# Altium project AUV maincontrol V2.0.PrjPcb
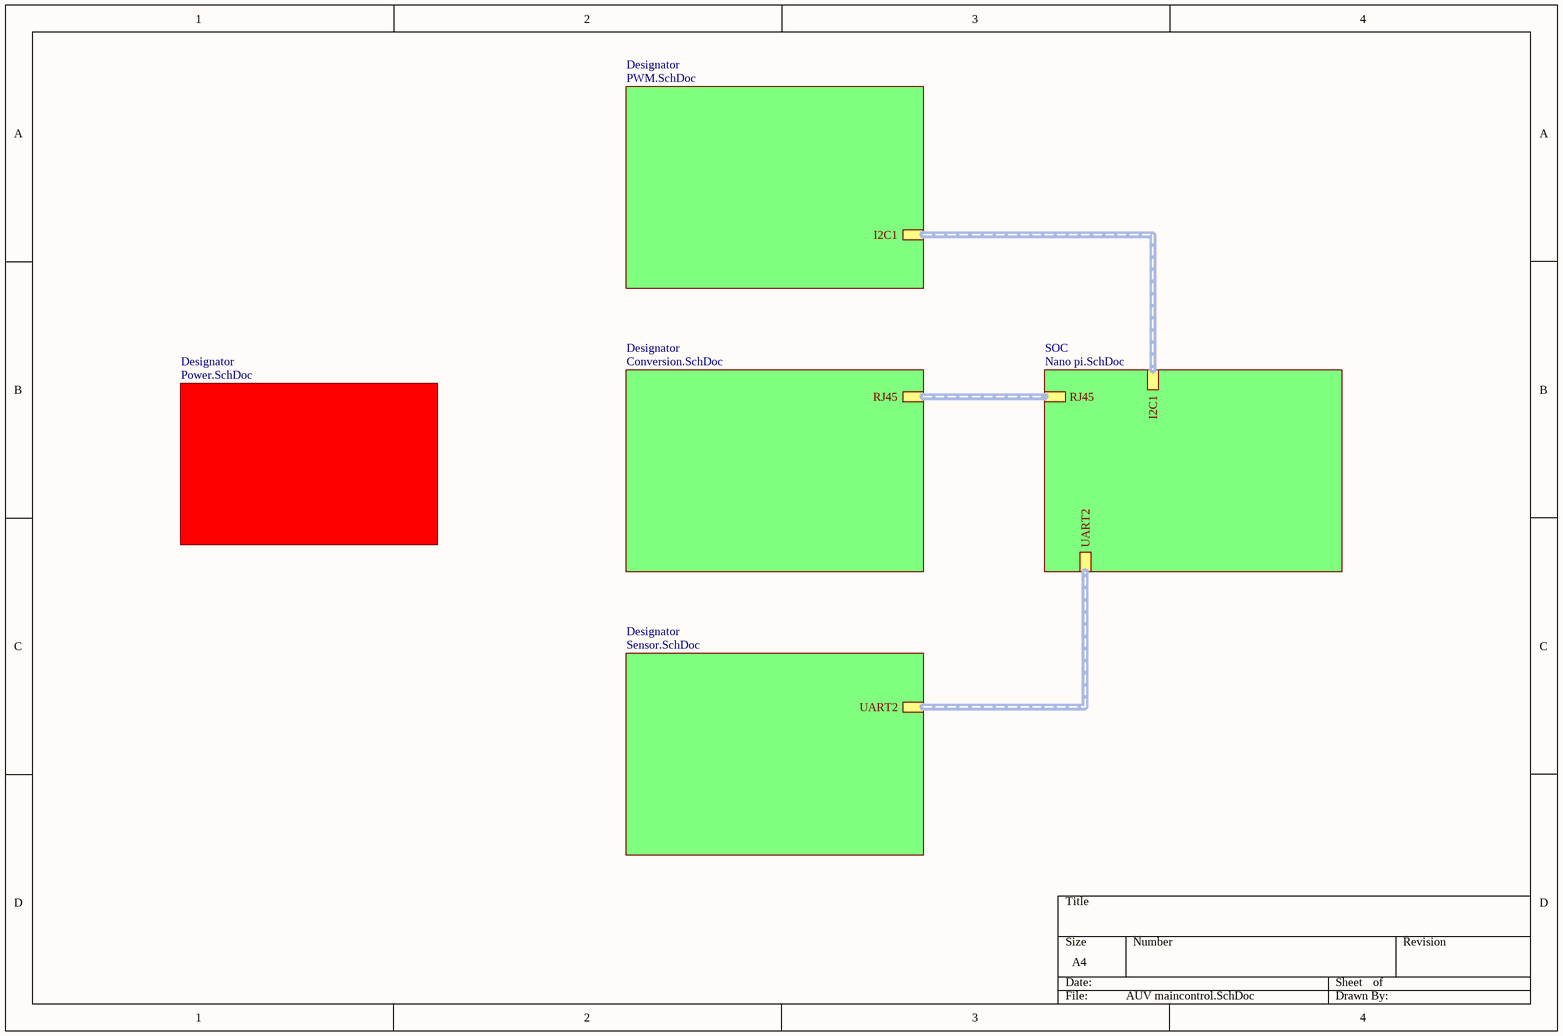
[diagram p0: AUV maincontrol.SchDoc]
6 sheets, 195 parts. Net scope: hierarchical (ports join the sheet entries above them; power ports are global).
Board file: AUV maincontrol.PcbDoc
Sheets:
  AUV maincontrol.SchDoc
    SOC = Nano pi.SchDoc
    Designator = Power.SchDoc
    Designator = Conversion.SchDoc
    Designator = PWM.SchDoc
    Designator = Sensor.SchDoc

## Sheet AUV maincontrol.SchDoc
size A4; SheetNumber: 1; SheetTotal: 6

### Sub-sheets
Designator = Power.SchDoc: no entries
Designator = Conversion.SchDoc: RJ45
Designator = PWM.SchDoc: I2C1
Designator = Sensor.SchDoc: UART2
SOC = Nano pi.SchDoc: RJ45, UART2, I2C1

### Buses and harness runs
harness sheet Designator/I2C1 = sheet SOC/I2C1
harness sheet Designator/RJ45 = sheet SOC/RJ45
harness sheet Designator/UART2 = sheet SOC/UART2

## Sheet Nano pi.SchDoc
size A3; SheetNumber: 3; SheetTotal: 6
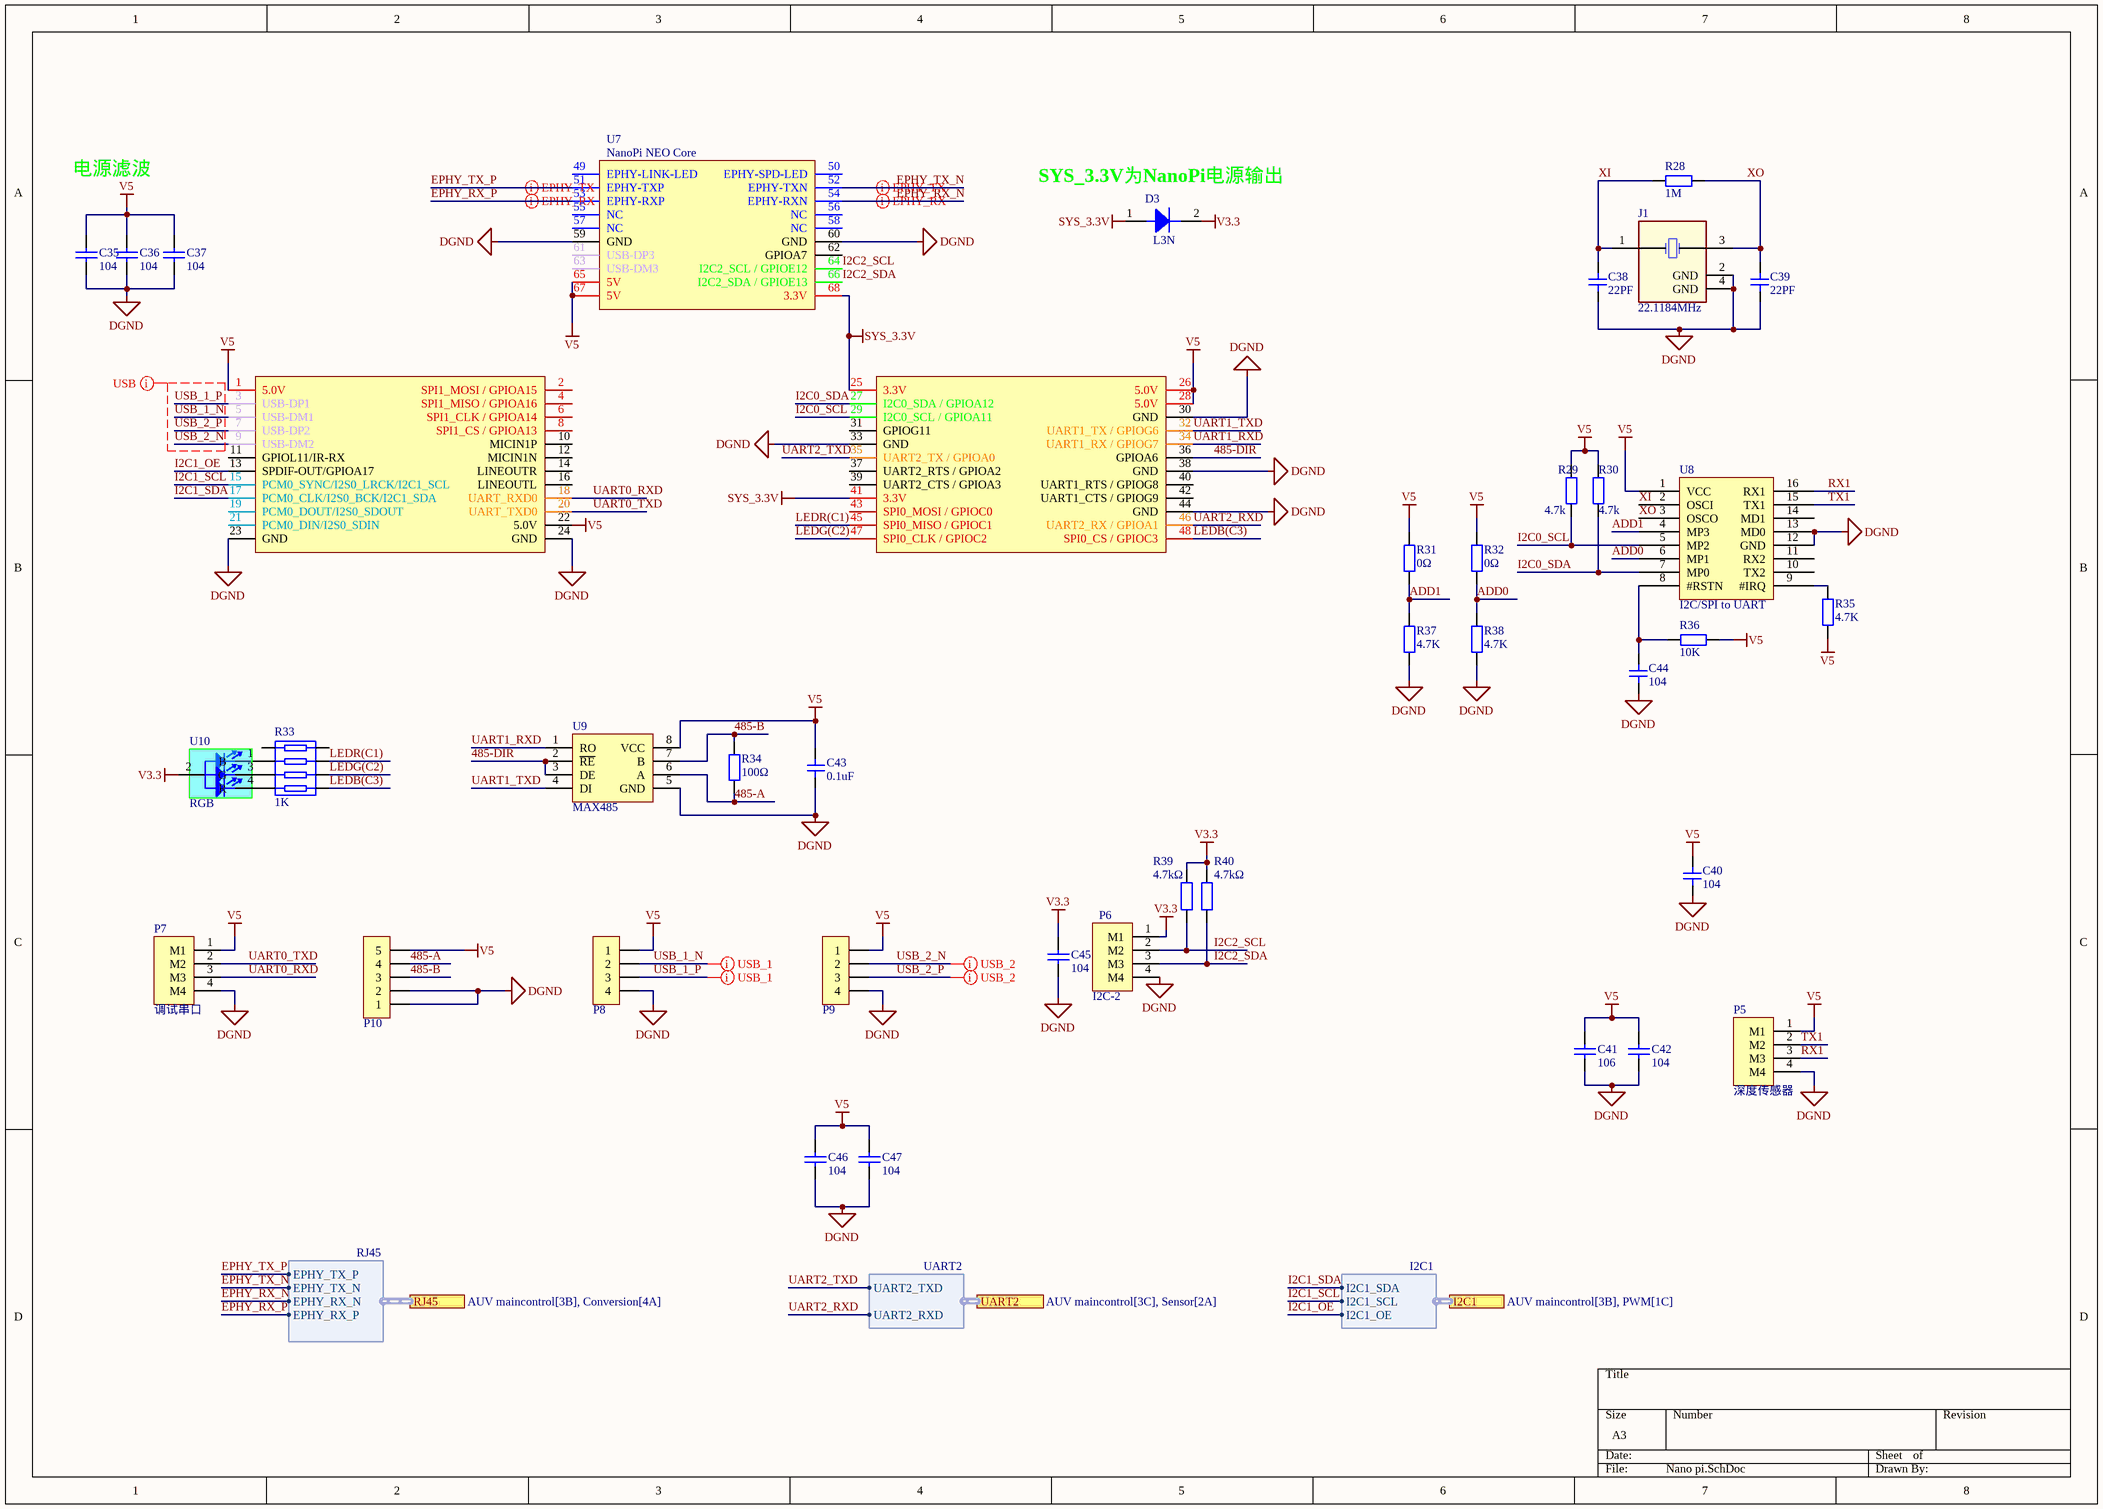
[diagram p1: Nano pi.SchDoc]

### Parts
C35  104  [0603_C]
C36  104  [0603_C]
C37  104  [0603_C]
C38  22PF  [0603_C]
C39  22PF  [0603_C]
C40  104  [0603_C]
C41  106  [0603_C]
C42  104  [0603_C]
C43  0.1uF  [0603_C]
C44  104  [0603_C]
C45  104  [0603_C]
C46  104  [0603_C]
C47  104  [0603_C]
D3  L3N  [SOD-123]
J1  22.1184MHz  [SMD-3225_4P]
P5  深度传感器  [MX1.25S-4P]
P6  I2C-2  [MX1.25S-4P]
P7  调试串口  [MX1.25S-4P]
P8  HDR-1X4  [PH2.0-LS-4P]  (value not drawn)
P9  HDR-1X4  [PH2.0-LS-4P]  (value not drawn)
P10  HDR-1X5  [PH2.0-LS-5P]  (value not drawn)
R28  1M  [0603R]
R29  4.7k  [0603R]
R30  4.7k  [0603R]
R31  0Ω  [0603R]
R32  0Ω  [0603R]
R33  1K  [res-4]
R34  100Ω  [0603R]
R35  4.7K  [0603R]
R36  10K  [0603R]
R37  4.7K  [0603R]
R38  4.7K  [0603R]
R39  4.7kΩ  [0603_R]
R40  4.7kΩ  [0603_R]
U7  NanoPi NEO Core  [NanoPi NEO Core(无引脚名)]
U8  I2C/SPI to UART  [SOP65P780X195-16N]
U9  MAX485  [SOP-8]
U10  RGB  [RGB-3528]

### Ports
I2C1 (harness I2C1, see AUV maincontrol[3B], PWM[1C]), RJ45 (harness RJ45, see AUV maincontrol[3B], Conversion[4A]), UART2 (harness UART2, see AUV maincontrol[3C], Sensor[2A])

### Harnesses
RJ45: EPHY_TX_P, EPHY_TX_N, EPHY_RX_N, EPHY_RX_P
UART2: UART2_TXD, UART2_RXD
I2C1: I2C1_SDA, I2C1_SCL, I2C1_OE

### Nets
DGND: C35.1 C36.1 C37.1 C38.2 C39.2 C40.2 C41.1 C42.1 C43.1 C44.2 C45.1 C46.1 C47.1 J1.2(GND) J1.4(GND) P5.4(M4) P6.4(M4) P7.4(M4) P8.4 P9.4 P10.1 P10.2 R37.1 R38.1 U7.23(GND) U7.24(GND) U7.30(GND) U7.33(GND) U7.38(GND) U7.44(GND) U7.59(GND) U7.60(GND) U8.12(GND) U8.13(MD0) U9.5(GND)
SYS_3.3V: D3.1 U7.25(3.3V) U7.41(3.3V) U7.68(3.3V)
V3.3: C45.2 D3.2 P6.1(M1) R39.2 R40.2 U10.2
V5: C35.2 C36.2 C37.2 C40.1 C41.2 C42.2 C43.2 C46.2 C47.2 P5.1(M1) P7.1(M1) P8.1 P9.1 P10.5 R29.2 R30.2 R31.2 R32.2 R35.1 R36.2 U7.1(5.0V) U7.22(5.0V) U7.26(5.0V) U7.28(5.0V) U7.65(5V) U7.67(5V) U8.1(VCC) U9.8(VCC)
485-A: P10.4 R34.1 U9.6(A)
485-B: P10.3 R34.2 U9.7(B)
485-DIR: U7.36(GPIOA6) U9.2(~{RE}) U9.3(DE)
ADD0: R32.1 R38.2 U8.6(MP1)
ADD1: R31.1 R37.2 U8.4(MP3)
EPHY_RX_N: U7.54(EPHY-RXN) ; port RJ45.EPHY_RX_N
EPHY_RX_P: U7.53(EPHY-RXP) ; port RJ45.EPHY_RX_P
EPHY_TX_N: U7.52(EPHY-TXN) ; port RJ45.EPHY_TX_N
EPHY_TX_P: U7.51(EPHY-TXP) ; port RJ45.EPHY_TX_P
I2C0_SCL: R29.1 U7.29(I2C0_SCL_/_GPIOA11) U8.5(MP2)
I2C0_SDA: R30.1 U7.27(I2C0_SDA_/_GPIOA12) U8.7(MP0)
I2C1_OE: U7.13(SPDIF-OUT/GPIOA17) ; port I2C1.I2C1_OE
I2C1_SCL: U7.15(PCM0_SYNC/I2S0_LRCK/I2C1_SCL) ; port I2C1.I2C1_SCL
I2C1_SDA: U7.17(PCM0_CLK/I2S0_BCK/I2C1_SDA) ; port I2C1.I2C1_SDA
I2C2_SCL: P6.2(M2) R39.1 U7.64(I2C2_SCL_/_GPIOE12)
I2C2_SDA: P6.3(M3) R40.1 U7.66(I2C2_SDA_/_GPIOE13)
LEDB(C3): R33.5 U7.48(SPI0_CS_/_GPIOC3)
LEDG(C2): R33.6 U7.47(SPI0_CLK_/_GPIOC2)
LEDR(C1): R33.7 U7.45(SPI0_MISO_/_GPIOC1)
RX1: P5.3(M3) U8.16(RX1)
TX1: P5.2(M2) U8.15(TX1)
UART0_RXD: P7.3(M3) U7.18(UART_RXD0)
UART0_TXD: P7.2(M2) U7.20(UART_TXD0)
UART1_RXD: U7.34(UART1_RX_/_GPIOG7) U9.1(RO)
UART1_TXD: U7.32(UART1_TX_/_GPIOG6) U9.4(DI)
UART2_RXD: U7.46(UART2_RX_/_GPIOA1) ; port UART2.UART2_RXD
UART2_TXD: U7.35(UART2_TX_/_GPIOA0) ; port UART2.UART2_TXD
USB_1_N: P8.2 U7.5(USB-DM1)
USB_1_P: P8.3 U7.3(USB-DP1)
USB_2_N: P9.2 U7.9(USB-DM2)
USB_2_P: P9.3 U7.7(USB-DP2)
XI: C38.1 J1.1(OSC1) R28.2 U8.2(OSCI)
XO: C39.1 J1.3(OSC2) R28.1 U8.3(OSCO)
NetC44_1: C44.1 R36.1 U8.8(#RSTN)
NetR33_2: R33.2 U10.1(B)
NetR33_3: R33.3 U10.3(G)
NetR33_4: R33.4 U10.4(R)
NetR35_2: R35.2 U8.9(#IRQ)

Not connected (* = marked no-connect by the designer): R33 1 8; U7 2(SPI1_MOSI_/_GPIOA15) 4(SPI1_MISO_/_GPIOA16) 6(SPI1_CLK_/_GPIOA14) 8(SPI1_CS_/_GPIOA13) 10(MICIN1P) 11(GPIOL11/IR-RX) 12(MICIN1N) 14(LINEOUTR) 16(LINEOUTL) 19(PCM0_DOUT/I2S0_SDOUT) 21(PCM0_DIN/I2S0_SDIN) 31(GPIOG11) 37(UART2_RTS_/_GPIOA2) 39(UART2_CTS_/_GPIOA3) 40(UART1_RTS_/_GPIOG8) 42(UART1_CTS_/_GPIOG9) 43(SPI0_MOSI_/_GPIOC0) 49(EPHY-LINK-LED) 50(EPHY-SPD-LED) 55(NC) 56(NC) 57(NC) 58(NC) 61(USB-DP3) 62(GPIOA7) 63(USB-DM3); U8 10(TX2) 11(RX2) 14(MD1)

### Layout directives
differential pair: EPHY_RX_N, EPHY_RX_P, EPHY_TX_N, EPHY_TX_P, USB_1_N, USB_1_P, USB_2_N, USB_2_P
net class USB: USB_1_N, USB_1_P, USB_2_N, USB_2_P

### Notes on the sheet
- 电源滤波
- (near U7) SYS_3.3V为NanoPi电源输出

### Library data of the parts
C35-C37 C41 C42 C45-C47 = SMT_Cap: 贴片电容; ComponentLink1Description: 供应商链接; ComponentLink1URL: http://www.szlcsc.com/product/details_29010.html; Package: 0805; Supplier: LC; SuppliersPartNumber: C28260
C38-C40 C43 C44 = Cap1: 无极贴片电容
D3 = Diode: 二极管30V/2A
J1 = Oscillator_SMT_4P
P5-P7 = 接线端子-4PIN: 4PIN
P8 P9 = Header 4: 4P接插件; 封装库来自淘宝卖家  ID：黄晶宝石: 其他店铺购入均为盗版假冒封装库，请立即申请退款; 技术支持，联系售后: 唯一出售店铺网址https://shop463601444.taobao.com
P10 = Header 5: 5P接插件; 封装库来自淘宝卖家  ID：黄晶宝石: 其他店铺购入均为盗版假冒封装库，请立即申请退款; 技术支持，联系售后: 唯一出售店铺网址https://shop463601444.taobao.com
R28-R32 R34-R38 = Res: 电阻
R33 = Res-4: 排阻
R39 R40 = SMT_Res: 贴片电阻; ComponentLink1Description: 供应商链接; ComponentLink1URL: http://www.szlcsc.com/product/details_23980.html; Package: 0603; Supplier: LC; SuppliersPartNumber: C23253
U8 = WK2132-ISSG

## Sheet Power.SchDoc
size A3; SheetNumber: 2; SheetTotal: 6
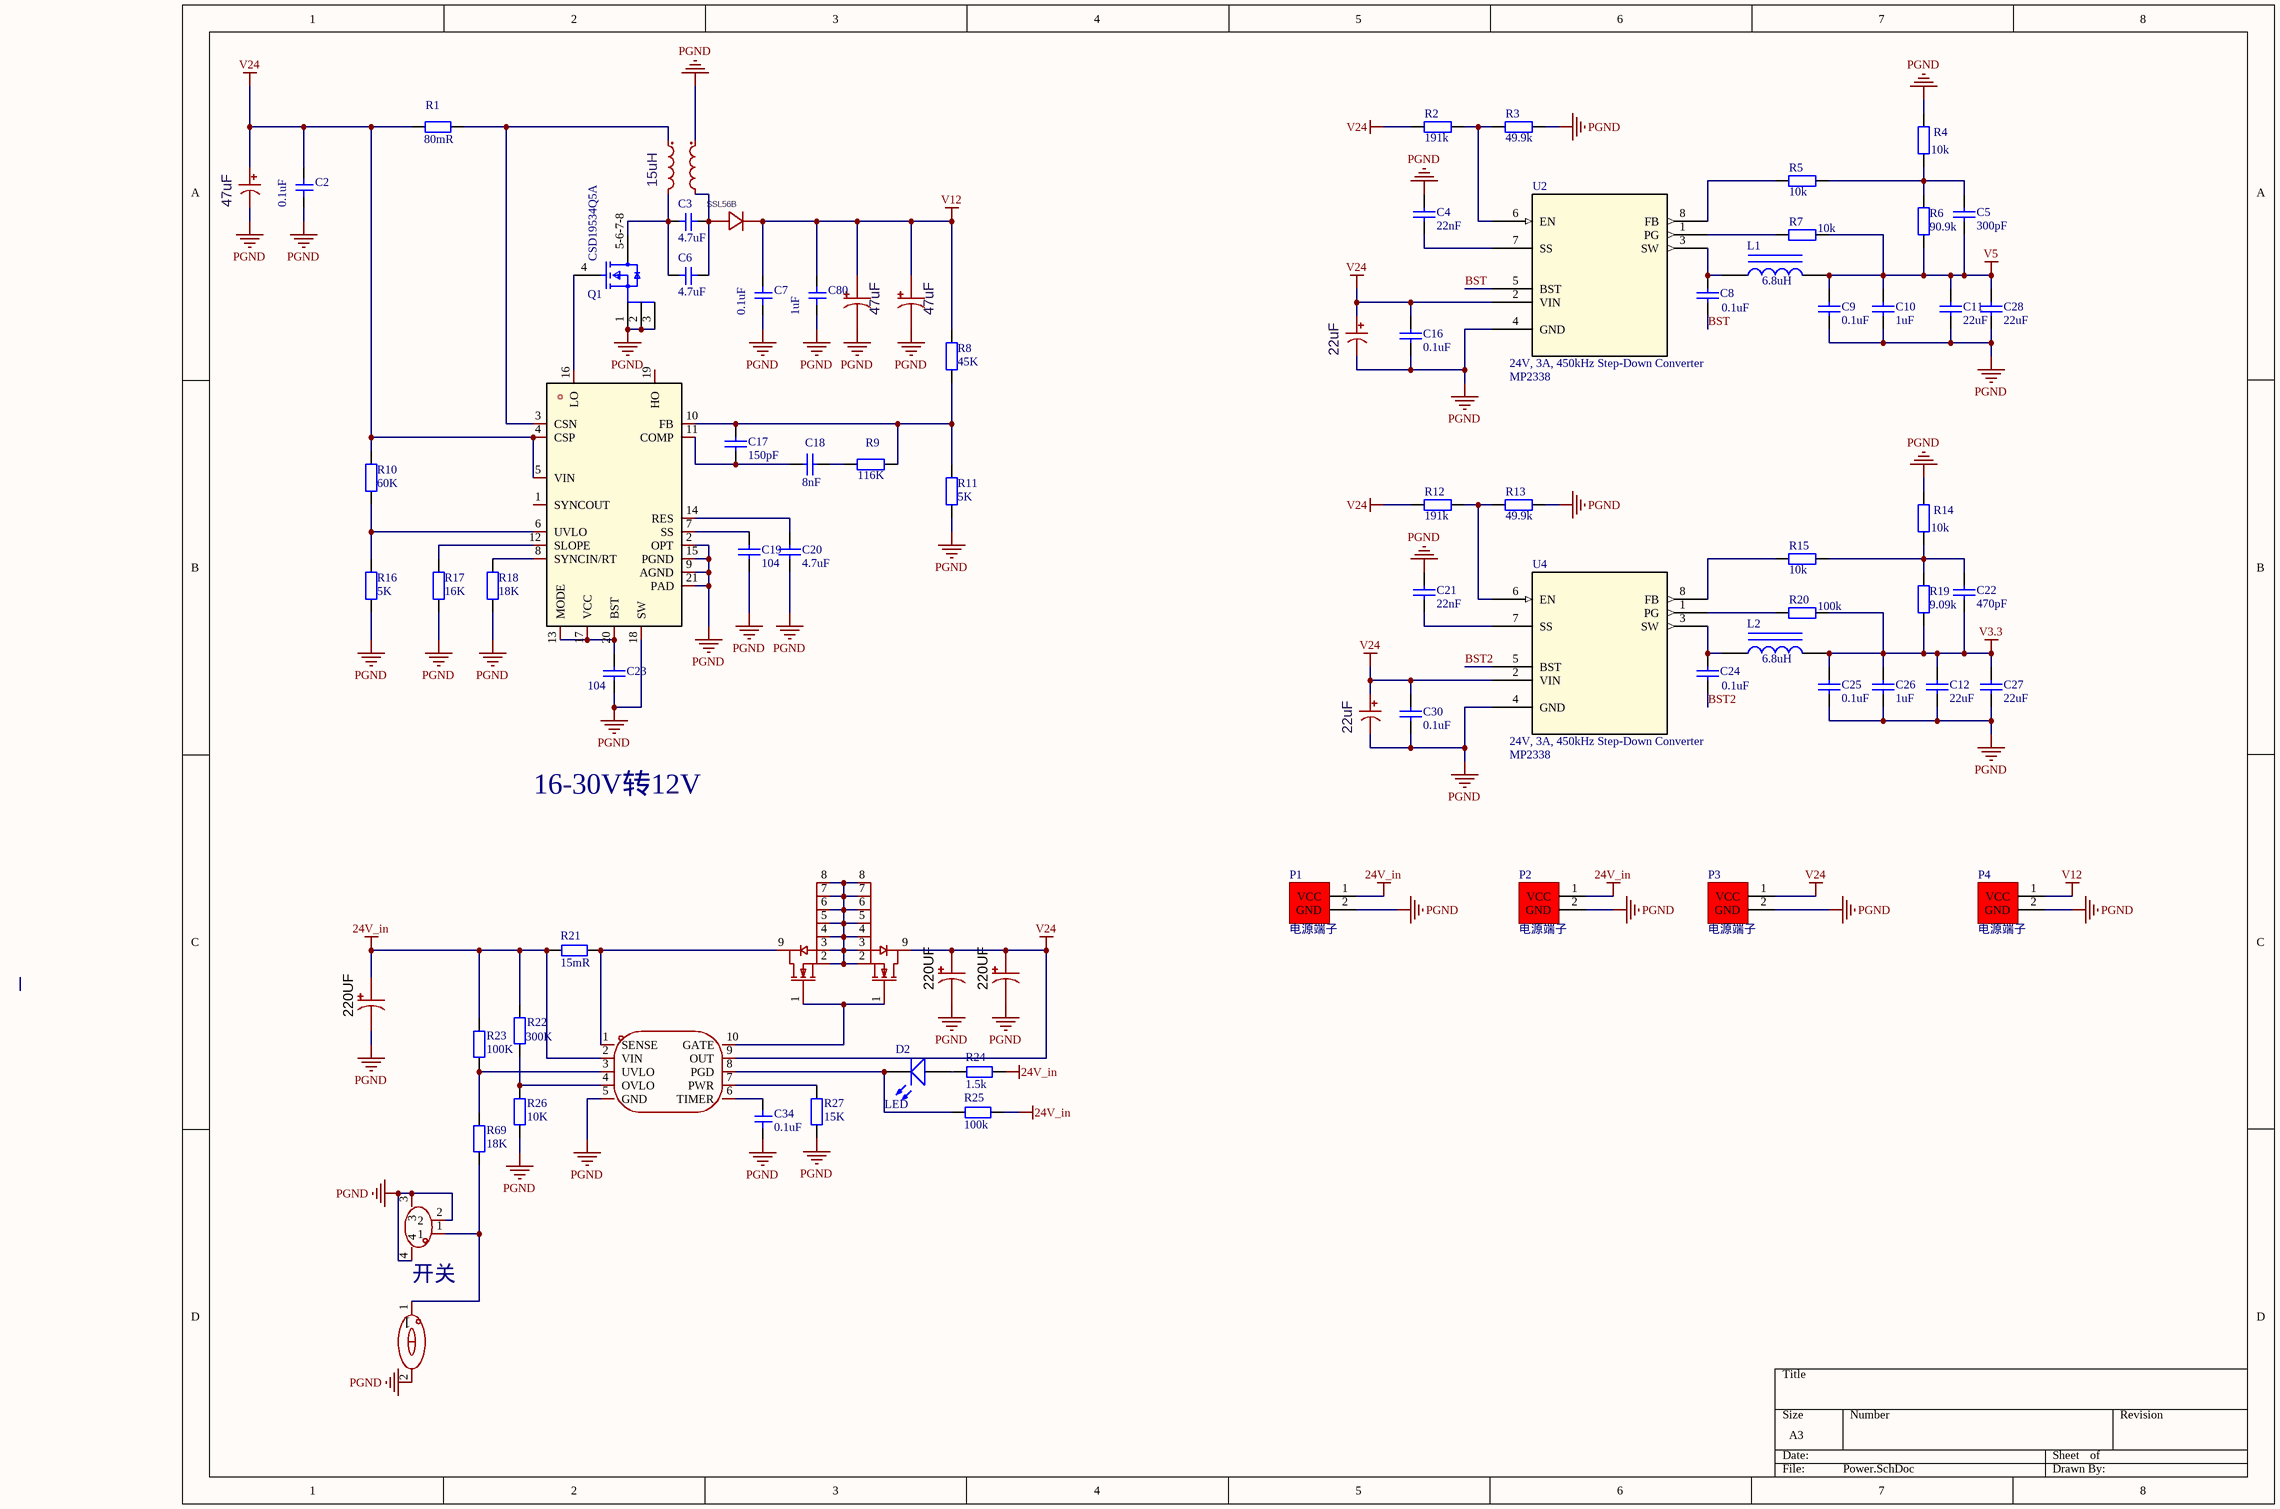
[diagram p2: Power.SchDoc]

### Parts
C1  47uF  [CAP-SMD_BD6.3-L6.6-W6.6-LS7.6-FD]
C2  0.1uF  [0603C]
C3  4.7uF  [1206_C]
C4  22nF  [0402_C]
C5  300pF  [0402_C]
C6  4.7uF  [1206_C]
C7  0.1uF  [0603C]
C8  0.1uF  [0603_C]
C9  0.1uF  [0603_C]
C10  1uF  [0603_C]
C11  22uF  [1210_C]
C12  22uF  [1210_C]
C13  47uF  [CAP-SMD_BD6.3-L6.6-W6.6-LS7.6-FD]
C14  47uF  [CAP-SMD_BD6.3-L6.6-W6.6-LS7.6-FD]
C15  22uF  [CAP-SMD_BD6.3-L6.6-W6.6-LS7.6-FD]
C16  0.1uF  [0603_C]
C17  150pF  [0402_C]
C18  8nF  [0402_C]
C19  104  [0402_C]
C20  4.7uF  [0603_C]
C21  22nF  [0402_C]
C22  470pF  [0402_C]
C23  104  [0402_C]
C24  0.1uF  [0603_C]
C25  0.1uF  [0603_C]
C26  1uF  [0603_C]
C27  22uF  [1210_C]
C28  22uF  [1210_C]
C29  22uF  [CAP-SMD_BD6.3-L6.6-W6.6-LS7.6-FD]
C30  0.1uF  [0603_C]
C31  220UF  [CAP-SMD_BD10.0-L10.3-W10.3-LS11.3-FD]
C32  220UF  [CAP-SMD_BD10.0-L10.3-W10.3-LS11.3-FD]
C33  220UF  [CAP-SMD_BD10.0-L10.3-W10.3-LS11.3-FD]
C34  0.1uF  [0402_C]
C80  1uF  [0603C]
D1  SSL56B  [SMBF_L4.3-W3.6-LS5.3-RD]
D2  LED  [0805_LED]
L1  6.8uH  [IND-SMD_L7.0-W6.6]
L2  6.8uH  [IND-SMD_L7.0-W6.6]
P1  电源端子  [XT60PB-F]
P2  电源端子  [XT60PB-F]
P3  电源端子  [XT60PB-F]
P4  电源端子  [XT30-F]
Q1  CSD19534Q5A  [FP-DQJ0008A-MFG]
Q2  HYG006N04LS1TA  [TOLL-8_L10.4-W9.9-P1.20-LS11.7-BL]  (value not drawn)
Q3  HYG006N04LS1TA  [TOLL-8_L10.4-W9.9-P1.20-LS11.7-BL]  (value not drawn)
R1  80mR  [2512]
R2  191k  [0402_R]
R3  49.9k  [0402_R]
R4  10k  [0402_R]
R5  10k  [0402_R]
R6  90.9k  [0402_R]
R7  10k  [0402_R]
R8  45K  [0402_R]
R9  116K  [0402_R]
R10  60K  [0402_R]
R11  5K  [0402_R]
R12  191k  [0402_R]
R13  49.9k  [0402_R]
R14  10k  [0402_R]
R15  10k  [0402_R]
R16  5K  [0402_R]
R17  16K  [0402_R]
R18  18K  [0402_R]
R19  9.09k  [0402_R]
R20  100k  [0402_R]
R21  15mR  [2512]
R22  300K  [0402_R]
R23  100K  [0402_R]
R24  1.5k  [0402_R]
R25  100k  [0402_R]
R26  10K  [0402_R]
R27  15K  [0402_R]
R69  18K  [0402_R]
SW1  DSIC01LS-P  [SW-SMD_2P-L3.5-W6.2-P2.54-LS9.8]  (value not drawn)
U1  15uH  [IND-SMD_4P-L12.0-W12.0_496R8C]
U2  24V, 3A, 450kHz Step-Down Converter  [SOT583_MP2338_MNP]
U3  LM5122MHX/NOPB  [HTSSOP-20_L6.5-W4.4-P0.65-LS6.4-BL-EP]  (value not drawn)
U4  24V, 3A, 450kHz Step-Down Converter  [SOT583_MP2338_MNP]
U5  LM5069MMX-2/NOPB  [VSSOP-10_L3.0-W3.0-P0.50-LS4.9-BL]  (value not drawn)
U6  ZX-XH2.54-2PLT  [HC-1.25-2]  (value not drawn)

### Nets
24V_in: C33.1 P1.1(VCC) P2.1(VCC) R21.2 R22.2 R23.2 R24.1 R25.1 U5.2(VIN)
PGND: C1.2 C2.1 C4.2 C7.1 C9.1 C10.1 C11.1 C12.1 C13.2 C14.2 C15.2 C16.1 C19.1 C20.1 C21.2 C23.1 C25.1 C26.1 C27.1 C28.1 C29.2 C30.1 C31.2 C32.2 C33.2 C34.1 C80.1 P1.2(GND) P2.2(GND) P3.2(GND) P4.2(GND) Q1.1(S) Q1.2(S) Q1.3(S) R3.1 R4.2 R11.1 R13.1 R14.2 R16.1 R17.1 R18.1 R26.1 R27.2 SW1.2(PIN2) U1.2 U2.4(GND) U3.2(OPT) U3.9(AGND) U3.15(PGND) U3.18(SW) U3.21(PAD) U4.4(GND) U5.5(GND) U6.2 U6.3 U6.4
V3.3: C12.2 C22.1 C25.2 C26.2 C27.2 L2.2 R19.1 R20.2
V5: C5.1 C9.2 C10.2 C11.2 C28.2 L1.2 R6.1 R7.2
V12: C7.2 C13.1 C14.1 C80.2 D1.1 P4.1(VCC) R8.2
V24: C1.1 C2.2 C15.1 C16.2 C29.1 C30.2 C31.1 C32.1 P3.1(VCC) Q3.9(D) R1.1 R2.2 R10.2 R12.2 U2.2(VIN) U3.4(CSP) U3.5(VIN) U4.2(VIN) U5.9(OUT)
BST: C8.1 U2.5(BST)
BST2: C24.1 U4.5(BST)
NetC3_1: C3.1 C6.1 Q1.5-6-7-8(D) U1.3
NetC3_2: C3.2 C6.2 D1.2 U1.4
NetC4_1: C4.1 U2.7(SS)
NetC5_2: C5.2 R4.1 R5.1 R6.2
NetC8_2: C8.2 L1.1 U2.3(SW)
NetC17_1: C17.1 C18.1 U3.11(COMP)
NetC17_2: C17.2 R8.1 R9.2 R11.2 U3.10(FB)
NetC18_2: C18.2 R9.1
NetC19_2: C19.2 U3.7(SS)
NetC20_2: C20.2 U3.14(RES)
NetC21_1: C21.1 U4.7(SS)
NetC22_2: C22.2 R14.1 R15.1 R19.2
NetC23_2: C23.2 U3.13(MODE) U3.17(VCC) U3.20(BST)
NetC24_2: C24.2 L2.1 U4.3(SW)
NetC34_2: C34.2 U5.6(TIMER)
NetD2_A: D2.A R24.2
NetD2_K: D2.K R25.2 U5.8(PGD)
NetQ1_4: Q1.4(G) U3.16(LO)
NetQ2_1: Q2.1(G) Q3.1(G) U5.10(GATE)
NetQ2_2: Q2.2(S) Q2.3(S) Q2.4(S) Q2.5(S) Q2.6(S) Q2.7(S) Q2.8(S) Q3.2(S) Q3.3(S) Q3.4(S) Q3.5(S) Q3.6(S) Q3.7(S) Q3.8(S)
NetQ2_9: Q2.9(D) R21.1 U5.1(SENSE)
NetR1_2: R1.2 U1.1 U3.3(CSN)
NetR2_1: R2.1 R3.2 U2.6(EN)
NetR5_2: R5.2 U2.8(FB)
NetR7_1: R7.1 U2.1(PG)
NetR10_1: R10.1 R16.2 U3.6(UVLO)
NetR12_1: R12.1 R13.2 U4.6(EN)
NetR15_2: R15.2 U4.8(FB)
NetR17_2: R17.2 U3.12(SLOPE)
NetR18_2: R18.2 U3.8(SYNCIN/RT)
NetR20_1: R20.1 U4.1(PG)
NetR22_1: R22.1 R26.2 U5.4(OVLO)
NetR23_1: R23.1 R69.2 U5.3(UVLO)
NetR27_1: R27.1 U5.7(PWR)
NetR69_1: R69.1 SW1.1(PIN1) U6.1

Not connected (* = marked no-connect by the designer): U3 1(SYNCOUT) 19(HO)

### Notes on the sheet
- (near U2) MP2338
- (near U4) MP2338
- 16-30V转12V
- 开关

### Library data of the parts
C1 = cap: 电解电容; Manufacturer: ROQANG(容强); Symbol: RVT1H470M0607; Device: RVT1H470M0607_C72523; Add into BOM: yes; Tolerance: ±20%; Rated Voltage: 50V; Ripple Current: 66mA@120Hz; φD: 6.3mm; L: 7.7mm; Lifetime @ Temp: 2000hrs@105℃; LCSC Part Name: 47uF ±20% 50V; Supplier Part: C72523; Manufacturer Part: RVT1H470M0607; Supplier Footprint: SMD,D6.3xL7.7mm; JLCPCB Part Class: Extended Part; Datasheet: https://atta.szlcsc.com/upload/public/pdf/source/20170325/1490427950282.pdf; Supplier: LCSC; Convert to PCB: yes; Value: 47uF; Equivalent Series Resistance(ESR): -; Operating Temperature: -40℃~+105℃
C2 C3 C6 C7 C34 C80 = Cap1: 无极贴片电容
C4 C5 C8-C12 C16-C28 C30 = SMT_Cap: 贴片电容; ComponentLink1Description: 供应商链接; ComponentLink1URL: http://www.szlcsc.com/product/details_29010.html; Package: 0805; Supplier: LC; SuppliersPartNumber: C28260
C13 C14 = cap2: 47uf 63v 2.1A@100KHZ; Manufacturer: PANASONIC(松下); Symbol: 50SVPF39M; Add into BOM: yes; Value: 39uF; Tolerance: ±20%; Rated Voltage: 50V; Ripple Current: 3.8A@100kHz; Equivalent Series Resistance(ESR): 25mΩ@100kHz; Type: 聚合物; φD: 8mm; L: 11.9mm; Lifetime @ Temp: 5000hrs@105℃; Device: 50SVPF39M; LCSC Part Name: 39uF ±20% 50V; Supplier Part: C193240; Manufacturer Part: 50SVPF39M; Supplier Footprint: SMD,D8xL11.9mm; JLCPCB Part Class: Extended Part; Datasheet: https://atta.szlcsc.com/upload/public/pdf/source/20180515/C193240_1760EBD42554E7EBE44F52996FA994CF.pdf; Supplier: LCSC; Convert to PCB: yes; Lead Spacing: 3.5mm; Operating Temperature: -55℃~+105℃
C15 C29 = cap: 电解电容; Manufacturer: ROQANG(容强); Symbol: RVT1H470M0607; Device: RVT1H470M0607_C72523; Add into BOM: yes; Value: 47uF; Tolerance: ±20%; Rated Voltage: 50V; Ripple Current: 66mA@120Hz; φD: 6.3mm; L: 7.7mm; Lifetime @ Temp: 2000hrs@105℃; LCSC Part Name: 47uF ±20% 50V; Supplier Part: C72523; Manufacturer Part: RVT1H470M0607; Supplier Footprint: SMD,D6.3xL7.7mm; JLCPCB Part Class: Extended Part; Datasheet: https://atta.szlcsc.com/upload/public/pdf/source/20170325/1490427950282.pdf; Supplier: LCSC; Convert to PCB: yes; Equivalent Series Resistance(ESR): -; Operating Temperature: -40℃~+105℃
C31-C33 = cap: 4.7uf 50v 14mA@120HZ; Manufacturer: ROQANG(容强); Symbol: VT1H4R7M0405; Add into BOM: yes; Tolerance: ±20%; φD: 4mm; L: 5.4mm; Lifetime @ Temp: 2000hrs@105℃; Device: VT1H4R7M0405; LCSC Part Name: 4.7uF ±20% 50V; Supplier Part: C213488; Manufacturer Part: VT1H4R7M0405; Supplier Footprint: SMD,D4xL5.4mm; JLCPCB Part Class: Extended Part; Datasheet: https://atta.szlcsc.com/upload/public/pdf/source/20180502/C191859_5B846418F1FC4C14CCCE0409874E2ED6.pdf; Supplier: LCSC; Convert to PCB: yes; Value: 4.7uF; Rated Voltage: 50V; Ripple Current: 14mA@120Hz; Equivalent Series Resistance(ESR): -; Operating Temperature: -40℃~+105℃
D1 = SSL56B_C28646279: 正向压降(Vf): 500mV@5A / 直流反向耐压(Vr): 60V / 整流电流: 5A 肖特基二极管; Manufacturer: 宏迦橙; Add into BOM: yes; Diode Configuration: 独立式; Reverse Leakage Current (Ir): 1mA@60V; Symbol: SSL56B_C28646279; Device: SSL56B_C28646279; LCSC Part Name: 电压:60V 电流:5A; Supplier Part: C28646279; Manufacturer Part: SSL56B; Supplier Footprint: SMB; JLCPCB Part Class: Extended Part; Datasheet: https://atta.szlcsc.com/upload/public/pdf/source/20240711/BA5CC29A704E203730EE96C503711B74.pdf; Supplier: LCSC; Convert to PCB: yes; Forward Voltage (Vf@If): 500mV@5A; Reverse Voltage (Vr): 60V; Rectified Current: 5A
D2 = LED: 发光二极管; ComponentLink1Description: 供应商链接; ComponentLink1URL: http://www.szlcsc.com/product/details_2663.html; Package: 0603; Supplier: LC; SuppliersPartNumber: C2290
L1 L2 = SMT_Iud_Power: 功率电感; ComponentLink1Description: 供应商链接; ComponentLink1URL: http://www.szlcsc.com/product/details_30010.html; Package: 0603; Supplier: LC; SuppliersPartNumber: C29258
Q1 = CMP-04962-000018-1: MOSFET N-CH 100V 50 8SON; Manufacturer: Texas Instruments; Reverse Recovery Time: 53ns; Turn Off Delay Time: 20ns; Gate To Source Voltage: 20V; Turn On Delay Time: 9ns; Depletion Mode: False; Threshold Vgs Max: 3.4V; Pulse Drain Current: 137A; Number Of N Channels: 1; Input Capacitace At Vds: 1290pF @ 50V; Max Junction Temp: +150°C; Power Dissipation: 3.2W; Max Forward Diode Voltage: 1V; Continuous Drain Current: 10A; Drain To Source Resistance: 12.6mΩ; Threshold Vgs Min: 2.4V; Transconductance: 47S; Gate Charge At Vgs: 17nC @ 10V; Reverse Recovery Charge: 134nC; Typ Forward Diode Voltage: 0.8V; Rthja Max: 50°C/W; Drain To Source Breakdown Voltage: 100V; Device Class L2: Transistors; Height: 1.1mm; Temperature Range Low: -55°C; Temperature Range High: +150°C; Temperature: -55°C to +150°C; Device Class L1: Discrete Semiconductors; ComponentLink2Description: Datasheet; Number Of Channels: 1; Lead Free: Yes; Octopart: https://octopart.com/csd19534q5a-texas+instruments-46749514; Package: DQJ0008A; Category: Trans; Mouser Description: MOSFET N-Channel MOSFET; Device Class L3: MOSFETs; Digikey Description: MOSFET N-CH 100V 50 8SON; Drain To Source Voltage: 100V; Automotive: No; ComponentLink2URL: http://www.ti.com/lit/ds/symlink/csd19534q5a.pdf; RoHS: TRUE; Manufacturer Part Number: CSD19534Q5A
Q2 Q3 = HYG006N04LS1TA: Manufacturer: HUAYI(华羿微); Add into BOM: yes; Type: 1个N沟道; Drain Source Voltage (Vdss): 40V; Continuous Drain Current (Id): 600A; Drain Source On Resistance (RDS(on)@Vgs,Id): 0.61mΩ@4.5V,80A; Power Dissipation (Pd): 428W; Gate Threshold Voltage (Vgs(th)@Id): 1.8V@250uA; Total Gate Charge (Qg@Vgs): 230nC@10V; Input Capacitance (Ciss@Vds): 15.4nF@0V; Reverse Transfer Capacitance (Crss@Vds): 115pF; Symbol: HYG006N04LS1TA; Device: HYG006N04LS1TA; LCSC Part Name: 1个N沟道 耐压:40V 电流:600A; Supplier Part: C2982928; Manufacturer Part: HYG006N04LS1TA; Supplier Footprint: TOLL; JLCPCB Part Class: Extended Part; Datasheet: https://atta.szlcsc.com/upload/public/pdf/source/20220321/91BDC8248F772C15069ACBA52C025F8E.pdf; Supplier: LCSC; Convert to PCB: yes; Operating Temperature: -55℃~+175℃
R1 R21-R27 R69 = Res: 电阻
R2-R9 R11-R15 R19 R20 = SMT_Res: 贴片电阻; ComponentLink1Description: 供应商链接; ComponentLink1URL: http://www.szlcsc.com/product/details_23980.html; Package: 0603; Supplier: LC; SuppliersPartNumber: C23253
R10 R16-R18 = SMT_Res_1: 贴片电阻; ComponentLink1Description: 供应商链接; ComponentLink1URL: http://www.szlcsc.com/product/details_23980.html; Package: 0603; Supplier: LC; SuppliersPartNumber: C23253
SW1 = 拨码开关: 1P; Manufacturer: XKB Connectivity(中国星坤); Symbol: DSIC01LS-P_C600988; Add into BOM: yes; Circuit: 单刀单掷; Number of Positions: 1位; Pin Style: 鸥翼型; Current Rating: 25mA; Voltage Rating: 24V; Operating Life: 3千次; Device: DSIC01LS-P; LCSC Part Name: 平拨,凸起式 1位拨码开关; Supplier Part: C600988; Manufacturer Part: DSIC01LS-P; Supplier Footprint: SMD,3.5x6.2mm; JLCPCB Part Class: Extended Part; Datasheet: https://atta.szlcsc.com/upload/public/pdf/source/20181029/C319044_89B44386426E378AA9595AB22F0589AA.pdf; Supplier: LCSC; Convert to PCB: yes; Type: 平拨,凸起式; Lead Pitch: -; Operating Temperature: -20℃~+70℃; Color: 黑色
U1 = YPRH1207C-150M: 耦合电感 15uH 5A; Manufacturer: YJYCOIN(益嘉源); Add into BOM: yes; Symbol: YPRH1207C-150M; Device: YPRH1207C-150M; LCSC Part Name: 共模电感1207 15uH ±20% 5A 65mΩ; Supplier Part: C22387937; Manufacturer Part: YPRH1207C-150M; Supplier Footprint: SMD-4P,12x12mm; JLCPCB Part Class: Extended Part; Datasheet: https://atta.szlcsc.com/upload/public/pdf/source/20240423/295998868374F51F4A3F6DF00C7F68FC.pdf; Supplier: LCSC; Convert to PCB: yes
U2 U4 = MP2338GTL-P: High-Efficiency, 28V, 3A, 450kHz, / Synchronous Step-Down Converter / In SOT583 Package; Mfr_Name: Monolithic Power Systems; RefDes: RefDes; Type: Type
U3 = LM5122MHX/NOPB: Manufacturer: TI(德州仪器); Add into BOM: yes; Function: 升压型; Input Voltage: 4.5V~65V; Switching Frequency: 450kHz；875kHz; Synchronous Rectification: 是; Number of Outputs: 1; Topology: 升压式; Switch tube (built-in/external): 外置; Symbol: LM5122MHX/NOPB; Device: LM5122MHX/NOPB; LCSC Part Name: 宽输入范围同步升压控制器; Supplier Part: C77241; Manufacturer Part: LM5122MHX/NOPB; Supplier Footprint: HTSSOP-20-EP; JLCPCB Part Class: Extended Part; Datasheet: https://www.ti.com/cn/lit/gpn/lm5122; Supplier: LCSC; Convert to PCB: yes; Output Current: -; Operating Temperature: -40℃~+125℃@(TJ)
U5 = LM5069MMX-2/NOPB: Manufacturer: TI(德州仪器); Add into BOM: yes; Voltage Rating: 9V~80V; Symbol: LM5069MMX-2/NOPB; Device: LM5069MMX-2/NOPB; LCSC Part Name: LM5069MMX 2/NOPB; Supplier Part: C2653582; Manufacturer Part: LM5069MMX-2/NOPB; Supplier Footprint: VSSOP-10-0.5mm; JLCPCB Part Class: Extended Part; Datasheet: https://www.ti.com/cn/lit/gpn/lm5069; Supplier: LCSC; Convert to PCB: yes
U6 = ZX-XH2.54-2PLT: Manufacturer: Megastar(兆星); Add into BOM: yes; Pins Structure: 1x2P; Pitch: 2.5mm; Reference Series: XH; Number of PINs Per Row: 2; Supplementary Features: 辅助焊脚; Z-Height of the Board: 8mm; X-Length of Bottom Edge on Board (Spacing Line): 10mm; Y-Width of Bottom Edge on Board: 8.3mm; Symbol: ZX-XH2.54-2PLT; Device: ZX-XH2.54-2PLT; LCSC Part Name: 1x2P 间距:2.5mm 立贴 系列:XH; Supplier Part: C7429680; Manufacturer Part: ZX-XH2.54-2PLT; Supplier Footprint: SMD,P=2.5mm,立贴; JLCPCB Part Class: Extended Part; Datasheet: https://atta.szlcsc.com/upload/public/pdf/source/20230619/87C018EBE425F10E4B035B436CF5FBBC.pdf; Supplier: LCSC; Convert to PCB: yes; Mounting Type: 立贴; Number of Pins: 2P; Number of Rows: 1; Row Spacing: -; Current Rating: -; Contact Material: 黄铜; Contact Plating: 锡; Operating Temperature: -; Voltage Rating: -; Plastic Material: -; Flame Retardant Rating: -; Color: 米色

## Sheet Conversion.SchDoc
size A2; SheetNumber: 4; SheetTotal: 6
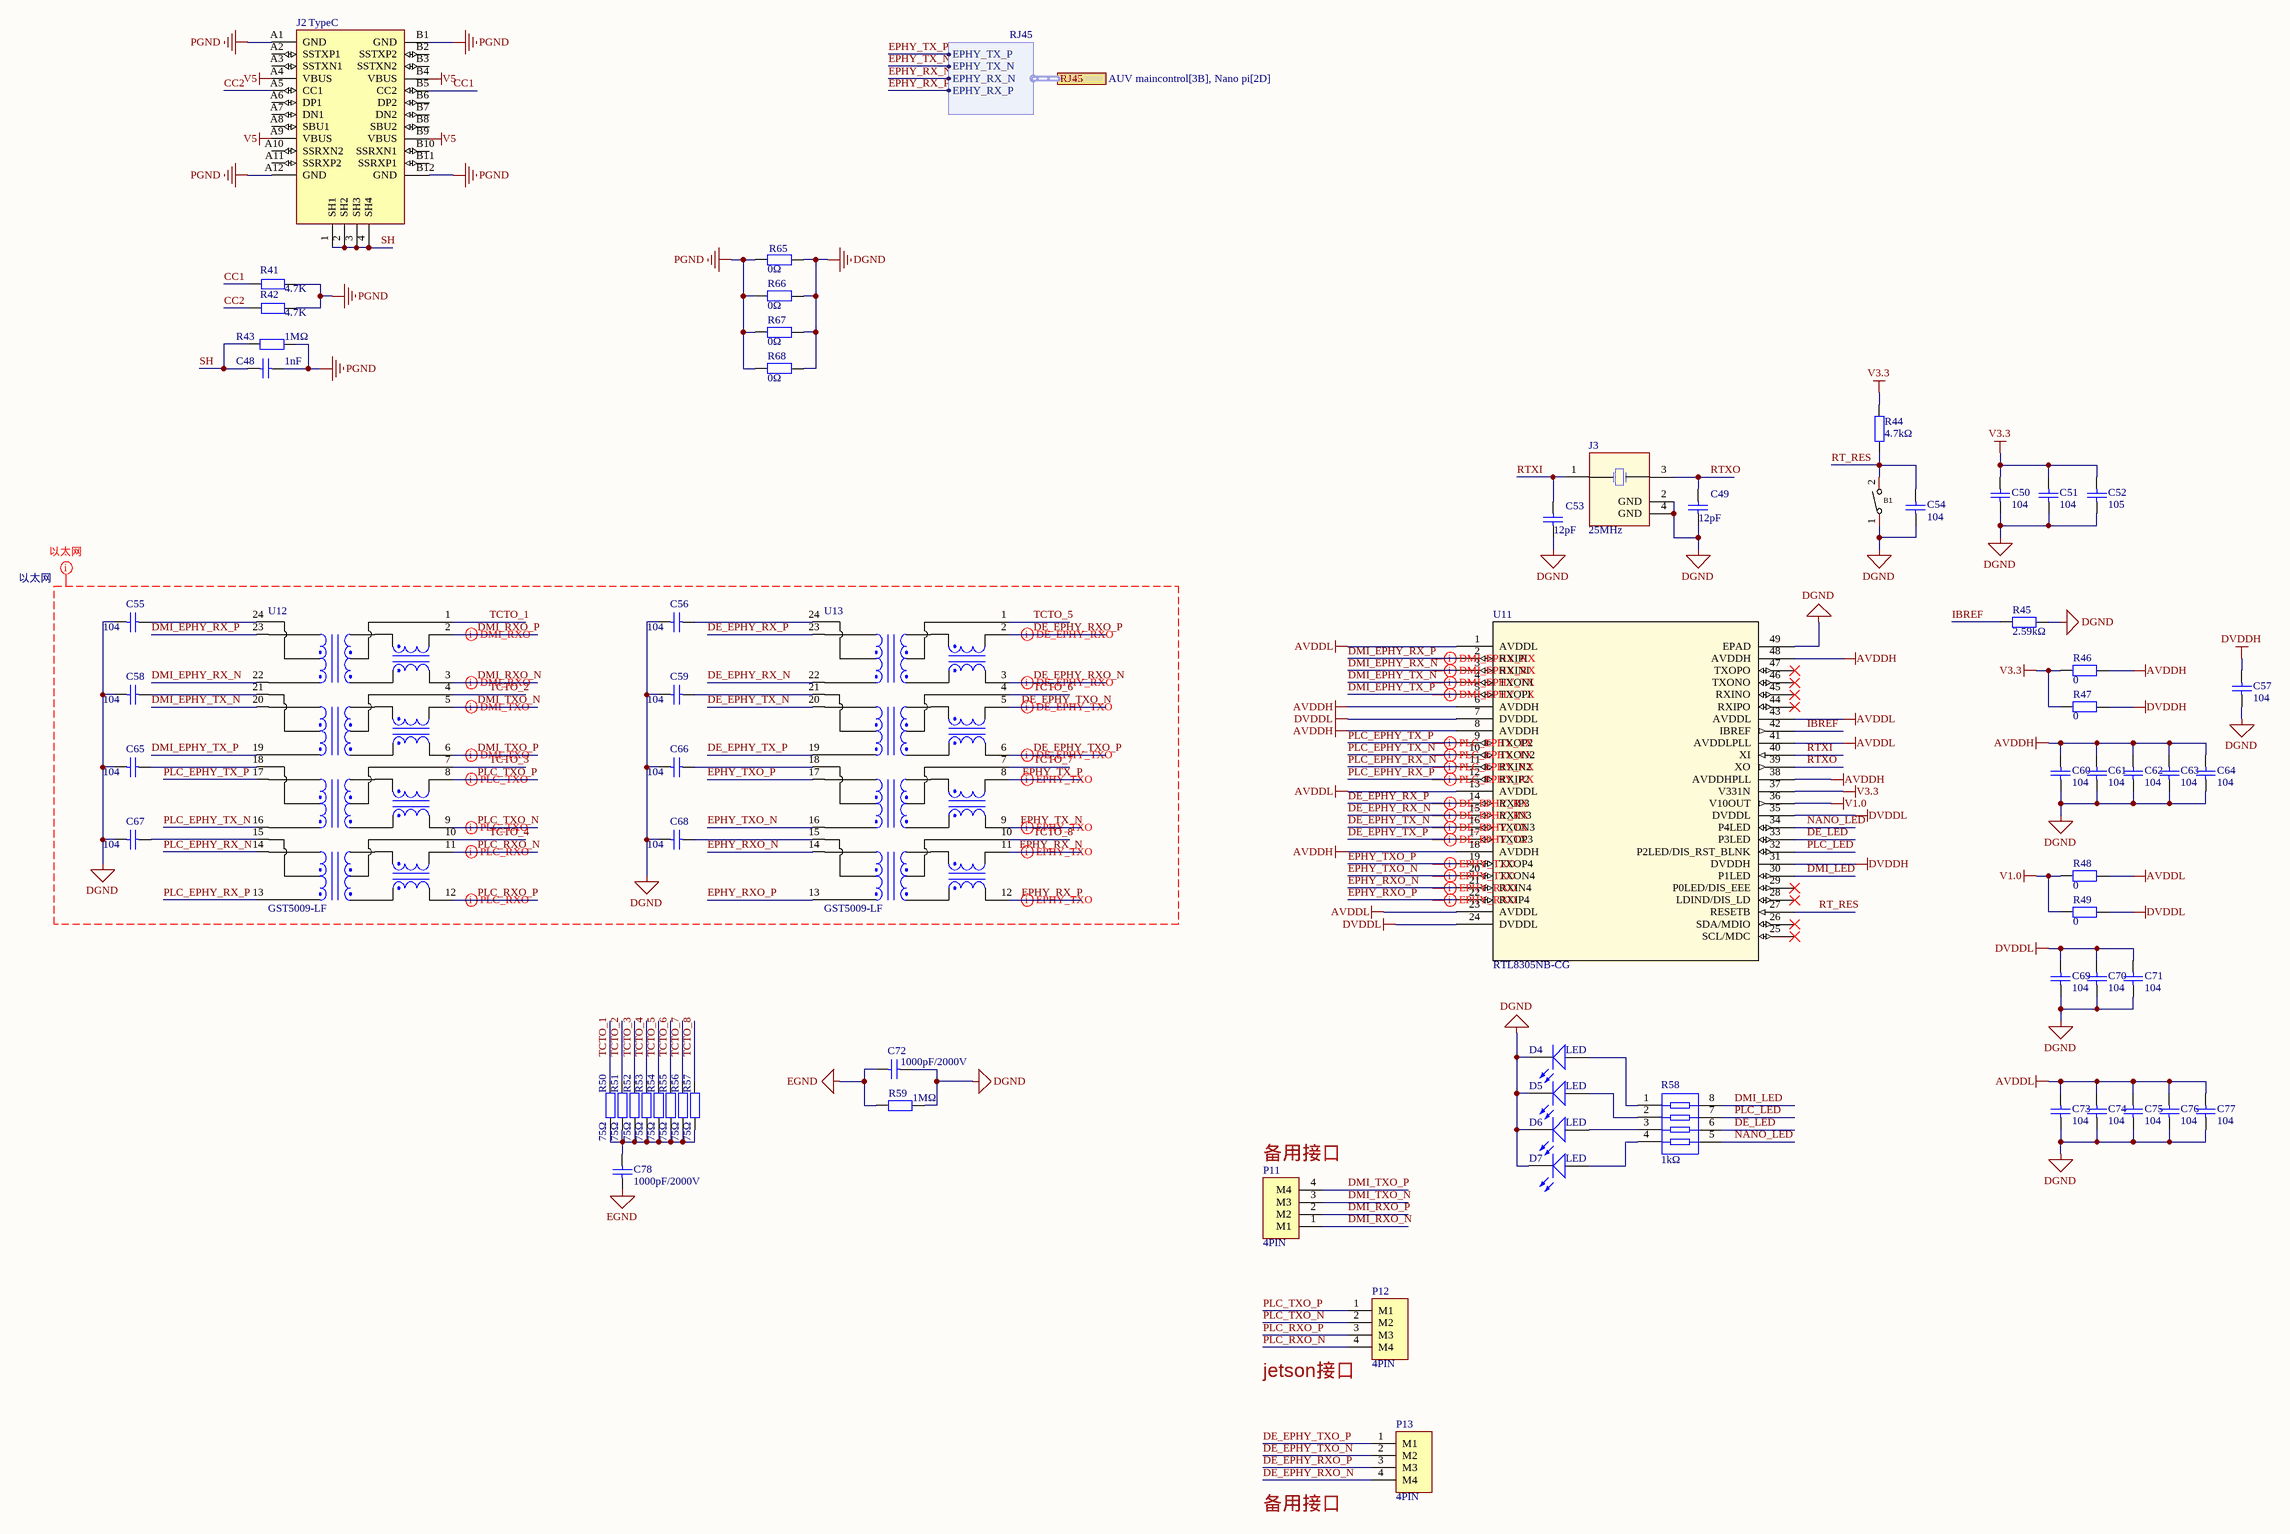
[diagram p3: Conversion.SchDoc]

### Parts
B1  Bottom-2P-1Way  [SW-SMD_L4.0-W2.9-LS5.0]  (value not drawn)
C48  1nF  [1210_C]
C49  12pF  [0603_C]
C50  104  [0402_C]
C51  104  [0402_C]
C52  105  [0402_C]
C53  12pF  [0603_C]
C54  104  [0402_C]
C55  104  [0402_C]
C56  104  [0402_C]
C57  104  [0402_C]
C58  104  [0402_C]
C59  104  [0402_C]
C60  104  [0402_C]
C61  104  [0402_C]
C62  104  [0402_C]
C63  104  [0402_C]
C64  104  [0402_C]
C65  104  [0402_C]
C66  104  [0402_C]
C67  104  [0402_C]
C68  104  [0402_C]
C69  104  [0402_C]
C70  104  [0402_C]
C71  104  [0402_C]
C72  1000pF/2000V  [1210_C]
C73  104  [0402_C]
C74  104  [0402_C]
C75  104  [0402_C]
C76  104  [0402_C]
C77  104  [0402_C]
C78  1000pF/2000V  [1210_C]
D4  LED  [0805_LED]
D5  LED  [0805_LED]
D6  LED  [0805_LED]
D7  LED  [0805_LED]
J2  TypeC  [TYPE-C 16P]
J3  25MHz  [SMD-3225_4P]
P11  4PIN  [MX1.25S-4P]
P12  4PIN  [MX1.25S-4P]
P13  4PIN  [MX1.25S-4P]
R41  4.7K  [0603R]
R42  4.7K  [0603R]
R43  1MΩ  [1206_R]
R44  4.7kΩ  [0402_R]
R45  2.59kΩ  [0402_R]
R46  0  [0402_R]
R47  0  [0402_R]
R48  0  [0402_R]
R49  0  [0402_R]
R50  75Ω  [0402_R]
R51  75Ω  [0402_R]
R52  75Ω  [0402_R]
R53  75Ω  [0402_R]
R54  75Ω  [0402_R]
R55  75Ω  [0402_R]
R56  75Ω  [0402_R]
R57  75Ω  [0402_R]
R58  1kΩ  [0603_Rx4]
R59  1MΩ  [0603_R]
R65  0Ω  [1206_R]
R66  0Ω  [1206_R]
R67  0Ω  [1206_R]
R68  0Ω  [1206_R]
U11  RTL8305NB-CG  [QFN48_RTL8305_RTK-M]
U12  GST5009-LF  [SOP100P1000X400-24N]
U13  GST5009-LF  [SOP100P1000X400-24N]

### Ports
RJ45 (harness RJ45, see AUV maincontrol[3B], Nano pi[2D])

### Harnesses
RJ45: EPHY_TX_P, EPHY_TX_N, EPHY_RX_N, EPHY_RX_P

### Nets
AVDDH: C60.1 C61.1 C62.1 C63.1 C64.1 R46.1 U11.6(AVDDH) U11.8(AVDDH) U11.18(AVDDH) U11.38(AVDDHPLL) U11.48(AVDDH)
AVDDL: C73.1 C74.1 C75.1 C76.1 C77.1 R48.1 U11.1(AVDDL) U11.13(AVDDL) U11.23(AVDDL) U11.41(AVDDLPLL) U11.43(AVDDL)
DGND: B1.1 C49.1 C50.1 C51.1 C52.1 C53.1 C54.1 C55.2 C56.2 C57.2 C58.2 C59.2 C60.2 C61.2 C62.2 C63.2 C64.2 C65.2 C66.2 C67.2 C68.2 C69.2 C70.2 C71.2 C72.1 C73.2 C74.2 C75.2 C76.2 C77.2 D4.K D5.K D6.K D7.K J3.2(GND) J3.4(GND) R45.1 R59.2 R65.2 R66.2 R67.2 R68.2 U11.49(EPAD)
DVDDH: C57.1 R47.1 U11.31(DVDDH)
DVDDL: C69.1 C70.1 C71.1 R49.1 U11.7(DVDDL) U11.24(DVDDL) U11.35(DVDDL)
EGND: C72.2 C78.1 R59.1
PGND: C48.2 J2.A1(GND) J2.A12(GND) J2.B1(GND) J2.B12(GND) R41.2 R42.2 R43.2 R65.1 R66.1 R67.1 R68.1
V1.0: R48.2 R49.2 U11.36(V10OUT)
V3.3: C50.2 C51.2 C52.2 R44.2 R46.2 R47.2 U11.37(V331N)
V5: J2.A4(VBUS) J2.A9(VBUS) J2.B4(VBUS) J2.B9(VBUS)
CC1: J2.B5(CC2) R41.1
CC2: J2.A5(CC1) R42.1
DE_EPHY_RX_N: U11.15(RXIN3) U13.22
DE_EPHY_RX_P: U11.14(RXIP3) U13.23
DE_EPHY_RXO_N: P13.4(M4) U13.3
DE_EPHY_RXO_P: P13.3(M3) U13.2
DE_EPHY_TX_N: U11.16(TXON3) U13.20
DE_EPHY_TX_P: U11.17(TXOP3) U13.19
DE_EPHY_TXO_N: P13.2(M2) U13.5
DE_EPHY_TXO_P: P13.1(M1) U13.6
DE_LED: R58.6 U11.33(P3LED)
DMI_EPHY_RX_N: U11.3(RXINI) U12.22
DMI_EPHY_RX_P: U11.2(RXIPI) U12.23
DMI_EPHY_TX_N: U11.4(TXONI) U12.20
DMI_EPHY_TX_P: U11.5(TXOPI) U12.19
DMI_LED: R58.8 U11.30(P1LED)
DMI_RXO_N: P11.1(M1) U12.3
DMI_RXO_P: P11.2(M2) U12.2
DMI_TXO_N: P11.3(M3) U12.5
DMI_TXO_P: P11.4(M4) U12.6
EPHY_RX_N: U13.11 ; port RJ45.EPHY_RX_N
EPHY_RX_P: U13.12 ; port RJ45.EPHY_RX_P
EPHY_RXO_N: U11.21(RXIN4) U13.14
EPHY_RXO_P: U11.22(RXIP4) U13.13
EPHY_TX_N: U13.9 ; port RJ45.EPHY_TX_N
EPHY_TX_P: U13.8 ; port RJ45.EPHY_TX_P
EPHY_TXO_N: U11.20(TXON4) U13.16
EPHY_TXO_P: U11.19(TXOP4) U13.17
IBREF: R45.2 U11.42(IBREF)
NANO_LED: R58.5 U11.34(P4LED)
PLC_EPHY_RX_N: U11.11(RXIN2) U12.14
PLC_EPHY_RX_P: U11.12(RXIP2) U12.13
PLC_EPHY_TX_N: U11.10(TXON2) U12.16
PLC_EPHY_TX_P: U11.9(TXOP2) U12.17
PLC_LED: R58.7 U11.32(P2LED/DIS_RST_BLNK)
PLC_RXO_N: P12.4(M4) U12.11
PLC_RXO_P: P12.3(M3) U12.12
PLC_TXO_N: P12.2(M2) U12.9
PLC_TXO_P: P12.1(M1) U12.8
RT_RES: B1.2 C54.2 R44.1 U11.27(RESETB)
RTXI: C53.2 J3.1(OSC1) U11.40(XI)
RTXO: C49.2 J3.3(OSC2) U11.39(XO)
SH: C48.1 J2.1(SH1) J2.2(SH2) J2.3(SH3) J2.4(SH4) R43.1
TCTO_1: R50.2 U12.1
TCTO_2: R51.2 U12.4
TCTO_3: R52.2 U12.7
TCTO_4: R53.2 U12.10
TCTO_5: R54.2 U13.1
TCTO_6: R55.2 U13.4
TCTO_7: R56.2 U13.7
TCTO_8: R57.2 U13.10
NetC55_1: C55.1 U12.24
NetC56_1: C56.1 U13.24
NetC58_1: C58.1 U12.21
NetC59_1: C59.1 U13.21
NetC65_1: C65.1 U12.18
NetC66_1: C66.1 U13.18
NetC67_1: C67.1 U12.15
NetC68_1: C68.1 U13.15
NetC78_2: C78.2 R50.1 R51.1 R52.1 R53.1 R54.1 R55.1 R56.1 R57.1
NetD4_A: D4.A R58.1
NetD5_A: D5.A R58.2
NetD6_A: D6.A R58.3
NetD7_A: D7.A R58.4

Not connected (* = marked no-connect by the designer): J2 A2(SSTXP1) A3(SSTXN1) A6(DP1) A7(DN1) A8(SBU1) A10(SSRXN2) A11(SSRXP2) B2(SSTXP2) B3(SSTXN2) B6(DP2) B7(DN2) B8(SBU2) B10(SSRXN1) B11(SSRXP1); U11 25(SCL/MDC)* 26(SDA/MDIO)* 28(LDIND/DIS_LD)* 29(P0LED/DIS_EEE)* 44(RXIPO)* 45(RXINO)* 46(TXONO)* 47(TXOPO)*

### Layout directives
differential pair: DE_EPHY_RX_N, DE_EPHY_RX_P, DE_EPHY_RXO_N, DE_EPHY_RXO_P, DE_EPHY_TX_N, DE_EPHY_TX_P, DE_EPHY_TXO_N, DE_EPHY_TXO_P, DMI_EPHY_RX_N, DMI_EPHY_RX_P, DMI_EPHY_TX_N, DMI_EPHY_TX_P, DMI_RXO_N, DMI_RXO_P, DMI_TXO_N, DMI_TXO_P, EPHY_RX_N, EPHY_RX_P, EPHY_RXO_N, EPHY_RXO_P, EPHY_TX_N, EPHY_TX_P, EPHY_TXO_N, EPHY_TXO_P, PLC_EPHY_RX_N, PLC_EPHY_RX_P, PLC_EPHY_TX_N, PLC_EPHY_TX_P, PLC_RXO_N, PLC_RXO_P, PLC_TXO_N, PLC_TXO_P
net class 以太网; net class *: DE_EPHY_RX_N, DE_EPHY_RX_P, DE_EPHY_RXO_N, DE_EPHY_RXO_P, DE_EPHY_TX_N, DE_EPHY_TX_P, DE_EPHY_TXO_N, DE_EPHY_TXO_P, DGND, DMI_EPHY_RX_N, DMI_EPHY_RX_P, DMI_EPHY_TX_N, DMI_EPHY_TX_P, DMI_RXO_N, DMI_RXO_P, DMI_TXO_N, DMI_TXO_P, EPHY_RX_N, EPHY_RX_P, EPHY_RXO_N, EPHY_RXO_P, EPHY_TX_N, EPHY_TX_P, EPHY_TXO_N, EPHY_TXO_P, PLC_EPHY_RX_N, PLC_EPHY_RX_P, PLC_EPHY_TX_N, PLC_EPHY_TX_P, PLC_RXO_N, PLC_RXO_P, PLC_TXO_N, PLC_TXO_P, TCTO_1, TCTO_2, TCTO_3, TCTO_4, TCTO_5, TCTO_6, TCTO_7, TCTO_8

### Notes on the sheet
- (near P11) 备用接口
- (near P12) jetson接口
- 备用接口

### Library data of the parts
B1 = Bottom-2P-1Way: 轻触按键; Manufacturer: SHOU HAN(首韩); Symbol: TS342A2P-WZ; Add into BOM: yes; Device: TS342A2P-WZ; LCSC Part Name: 轻触开关 3*4*2 两脚小龟不带柱 250gf 黑色塑胶按钮; Supplier Part: C557591; Manufacturer Part: TS342A2P-WZ; Supplier Footprint: SMD; JLCPCB Part Class: Extended Part; Datasheet: https://atta.szlcsc.com/upload/public/pdf/source/20200519/C557591_B3A5A21584733303F06306F18577DA8B.pdf; Supplier: LCSC; Convert to PCB: yes
C48-C78 = SMT_Cap: 贴片电容; ComponentLink1Description: 供应商链接; ComponentLink1URL: http://www.szlcsc.com/product/details_29010.html; Package: 0805; Supplier: LC; SuppliersPartNumber: C28260
D4-D7 = LED: 发光二极管; ComponentLink1Description: 供应商链接; ComponentLink1URL: http://www.szlcsc.com/product/details_2663.html; Package: 0603; Supplier: LC; SuppliersPartNumber: C2290
J3 = Oscillator_SMT_4P
P11-P13 = 接线端子-4PIN
R41 R42 = Res: 电阻
R43-R57 R59 R65-R68 = SMT_Res: 贴片电阻; ComponentLink1Description: 供应商链接; ComponentLink1URL: http://www.szlcsc.com/product/details_23980.html; Package: 0603; Supplier: LC; SuppliersPartNumber: C23253
R58 = SMT_Res-4: 贴片排阻; ComponentLink1Description: 供应商链接; ComponentLink1URL: http://www.szlcsc.com/product/details_26253.html; Package: 0603*4; Supplier: LC; SuppliersPartNumber: C25510
U11 = RTL8305NB-CG: 10/100M PHY; Mfr_Name: Realtek; Type: DEV; Copyright: Copyright (C) 2023 Ultra Librarian. All rights reserved.; Manufacturer_Part_Number: RTL8305NB-CG; RefDes: RefDes
U12 U13 = GST5009-LF: Network

## Sheet PWM.SchDoc
size A4; SheetNumber: 5; SheetTotal: 6
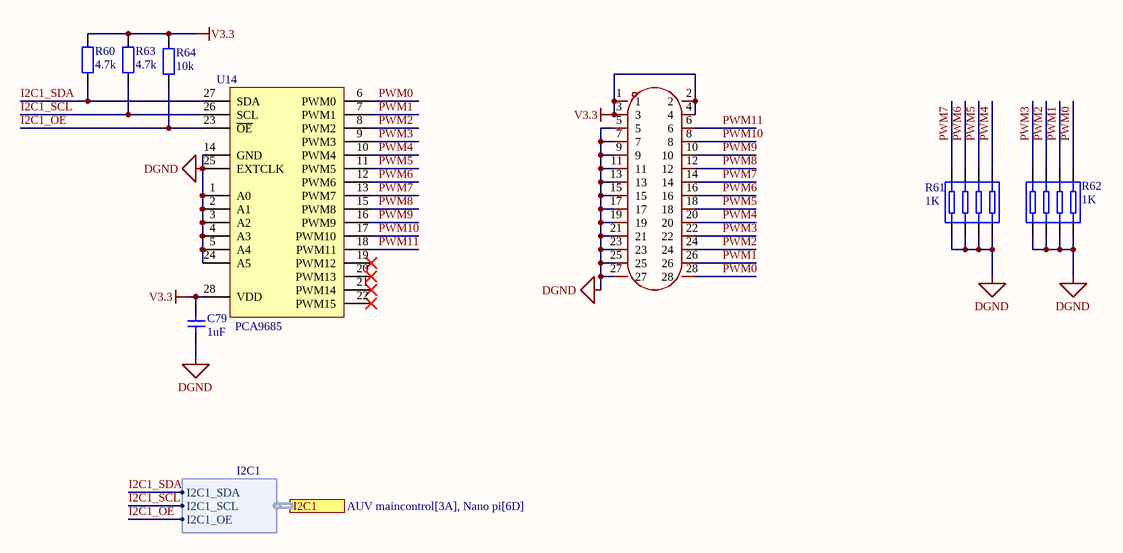
[diagram p4: PWM.SchDoc]

### Parts
C79  1uF  [0603_C]
R60  4.7k  [0603R]
R61  1K  [res-4]
R62  1K  [res-4]
R63  4.7k  [0603R]
R64  10k  [0603R]
U14  PCA9685  [TSSOP-28]
U15  XDFH-0254-2*14P  [CONN-TH_28P-P2.54_LX_XDFH-0254-2X14P]  (value not drawn)

### Ports
I2C1 (harness I2C1, see AUV maincontrol[3A], Nano pi[6D])

### Harnesses
I2C1: I2C1_SDA, I2C1_SCL, I2C1_OE

### Nets
DGND: C79.1 R61.1 R61.2 R61.3 R61.4 R62.1 R62.2 R62.3 R62.4 U14.1(A0) U14.2(A1) U14.3(A2) U14.4(A3) U14.5(A4) U14.14(GND) U14.24(A5) U14.25(EXTCLK) U15.5 U15.7 U15.9 U15.11 U15.13 U15.15 U15.17 U15.19 U15.21 U15.23 U15.25 U15.27
V3.3: C79.2 R60.2 R63.2 R64.2 U14.28(VDD) U15.1 U15.2 U15.3 U15.4
I2C1_OE: R64.1 U14.23(~{OE}) ; port I2C1.I2C1_OE
I2C1_SCL: R63.1 U14.26(SCL) ; port I2C1.I2C1_SCL
I2C1_SDA: R60.1 U14.27(SDA) ; port I2C1.I2C1_SDA
PWM0: R62.5 U14.6(PWM0) U15.28
PWM1: R62.6 U14.7(PWM1) U15.26
PWM2: R62.7 U14.8(PWM2) U15.24
PWM3: R62.8 U14.9(PWM3) U15.22
PWM4: R61.5 U14.10(PWM4) U15.20
PWM5: R61.6 U14.11(PWM5) U15.18
PWM6: R61.7 U14.12(PWM6) U15.16
PWM7: R61.8 U14.13(PWM7) U15.14
PWM8: U14.15(PWM8) U15.12
PWM9: U14.16(PWM9) U15.10
PWM10: U14.17(PWM10) U15.8
PWM11: U14.18(PWM11) U15.6

Not connected (* = marked no-connect by the designer): U14 19(PWM12)* 20(PWM13)* 21(PWM14)* 22(PWM15)*

### Library data of the parts
C79 = Cap1: 无极贴片电容
R60 R63 R64 = Res: 电阻
R61 R62 = Res-4: 排阻
U15 = XDFH-0254-2*14P: Manufacturer: LX(连欣科技); Add into BOM: yes; Connector Type: 简牛座; Pitch: 2.54mm; Structure: 2x14P; Current Rating (Max): 3A; Voltage Rating (Max): 500V; Holder Type: 直插; Pin Number in each Row: 14; Soldering Temperature(Max): 260℃; Symbol: XDFH-0254- 2*14P; Device: XDFH-0254-2*14P; LCSC Part Name: 镀2U全金品质简牛插座PH2.54MM-2*14PIN直插板 DIP; Supplier Part: C19193813; Manufacturer Part: XDFH-0254-2*14P; Supplier Footprint: 插件,P=2.54mm; JLCPCB Part Class: Extended Part; Datasheet: https://atta.szlcsc.com/upload/public/pdf/source/20231117/B05B179C28F8598ADEE3EE3DBCADEC41.pdf; Supplier: LCSC; Convert to PCB: yes; Number of Rows: 2; Contact Material: 铜; Contact Plating: 金; Operating Temperature Range: -45℃~+105℃

## Sheet Sensor.SchDoc
size A4; SheetNumber: 6; SheetTotal: 6
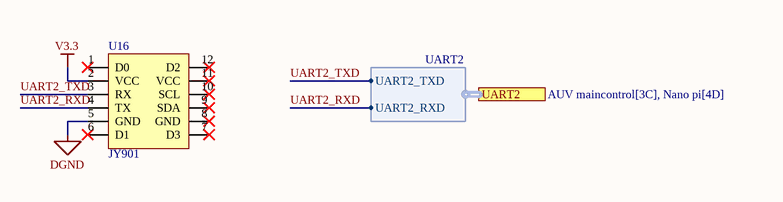
[diagram p5: Sensor.SchDoc]

### Parts
U16  JY901  [9轴模块(简易版)]

### Ports
UART2 (harness UART2, see AUV maincontrol[3C], Nano pi[4D])

### Harnesses
UART2: UART2_TXD, UART2_RXD

### Nets
DGND: U16.5(GND)
V3.3: U16.2(VCC)
UART2_RXD: U16.4(TX) ; port UART2.UART2_RXD
UART2_TXD: U16.3(RX) ; port UART2.UART2_TXD

Not connected (* = marked no-connect by the designer): U16 1(D0)* 6(D1)* 7(D3)* 8(GND)* 9(SDA)* 10(SCL)* 11(VCC)* 12(D2)*

### Library data of the parts
U16 = 9轴加速度计

## Nets that join several sheets
DGND: Nano pi (35 pins), Conversion (43 pins), PWM (29 pins), Sensor (U16.5)
PGND: Power (57 pins), Conversion (12 pins)
V3.3: Nano pi (6 pins), Power (8 pins), Conversion (7 pins), PWM (9 pins), Sensor (U16.2)
V5: Nano pi (28 pins), Power (8 pins), Conversion (J2.A4 J2.A9 J2.B4 J2.B9)
EPHY_RX_N: Nano pi (U7.54), Conversion (U13.11)
EPHY_RX_P: Nano pi (U7.53), Conversion (U13.12)
EPHY_TX_N: Nano pi (U7.52), Conversion (U13.9)
EPHY_TX_P: Nano pi (U7.51), Conversion (U13.8)
I2C1_OE: Nano pi (U7.13), PWM (R64.1 U14.23)
I2C1_SCL: Nano pi (U7.15), PWM (R63.1 U14.26)
I2C1_SDA: Nano pi (U7.17), PWM (R60.1 U14.27)
UART2_RXD: Nano pi (U7.46), Sensor (U16.4)
UART2_TXD: Nano pi (U7.35), Sensor (U16.3)